# EAGLE design atmega128ictop (EAGLE 7.2.0)
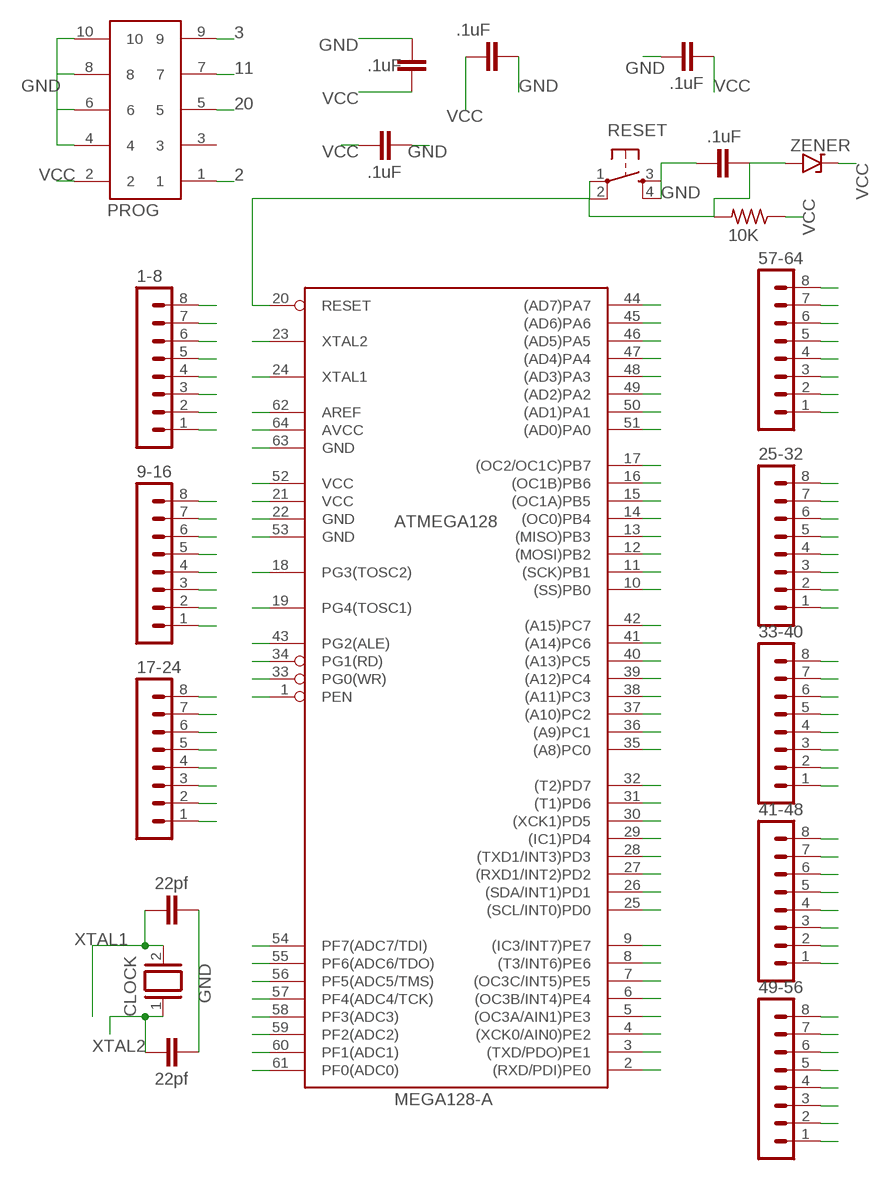
[diagram p0: schematic, sheet 1]

## Parts
1-8  MA08-1  [MA08-1]
9-16  MA08-1  [MA08-1]
17-24  MA08-1  [MA08-1]
25-32  MA08-1  [MA08-1]
33-40  MA08-1  [MA08-1]
41-48  MA08-1  [MA08-1]
49-56  MA08-1  [MA08-1]
57-64  MA08-1  [MA08-1]
ATMEGA128  MEGA128-A  [TQFP64]
C1  .1uF  C5/2.5  [C5B2.5]
C2  .1uF  C5/2.5  [C5B2.5]
C3  22pf  C5/2.5  [C5B2.5]
C4  22pf  C5/2.5  [C5B2.5]
C5  .1uF  C5/2.5  [C5B2.5]
C6  .1uF  C5/2.5  [C5B2.5]
C7  .1uF  C5/2.5  [C5B2.5]
CLOCK  XTAL/S  [QS]
D1  ZENER  1N9ZENER2  [DO35-2]
PROG  61201021621  [61201021621]
R1  10K  R-US_0204/5  [0204/5]
RESET  DTS-6  [DTS-6]

## Nets
1: 1-8.1 ATMEGA128.1(PEN)
2: 1-8.2 ATMEGA128.2((RXD/PDI)PE0) PROG.1
3: 1-8.3 ATMEGA128.3((TXD/PDO)PE1) PROG.9
4: 1-8.4 ATMEGA128.4((XCK0/AIN0)PE2)
5: 1-8.5 ATMEGA128.5((OC3A/AIN1)PE3)
6: 1-8.6 ATMEGA128.6((OC3B/INT4)PE4)
7: 1-8.7 ATMEGA128.7((OC3C/INT5)PE5)
8: 1-8.8 ATMEGA128.8((T3/INT6)PE6)
9: 9-16.1 ATMEGA128.9((IC3/INT7)PE7)
10: 9-16.2 ATMEGA128.10((SS)PB0)
11: 9-16.3 ATMEGA128.11((SCK)PB1) PROG.7
12: 9-16.4 ATMEGA128.12((MOSI)PB2)
13: 9-16.5 ATMEGA128.13((MISO)PB3)
14: 9-16.6 ATMEGA128.14((OC0)PB4)
15: 9-16.7 ATMEGA128.15((OC1A)PB5)
16: 9-16.8 ATMEGA128.16((OC1B)PB6)
17: 17-24.1 ATMEGA128.17((OC2/OC1C)PB7)
18: 17-24.2 ATMEGA128.18(PG3(TOSC2))
19: 17-24.3 ATMEGA128.19(PG4(TOSC1))
20: 17-24.4 ATMEGA128.20(RESET) C5.1 D1.A PROG.5 R1.2 RESET.1 RESET.2
25: 25-32.1 ATMEGA128.25((SCL/INT0)PD0)
26: 25-32.2 ATMEGA128.26((SDA/INT1)PD1)
27: 25-32.3 ATMEGA128.27((RXD1/INT2)PD2)
28: 25-32.4 ATMEGA128.28((TXD1/INT3)PD3)
29: 25-32.5 ATMEGA128.29((IC1)PD4)
30: 25-32.6 ATMEGA128.30((XCK1)PD5)
31: 25-32.7 ATMEGA128.31((T1)PD6)
32: 25-32.8 ATMEGA128.32((T2)PD7)
33: 33-40.1 ATMEGA128.33(PG0(WR))
34: 33-40.2 ATMEGA128.34(PG1(RD))
35: 33-40.3 ATMEGA128.35((A8)PC0)
36: 33-40.4 ATMEGA128.36((A9)PC1)
37: 33-40.5 ATMEGA128.37((A10)PC2)
38: 33-40.6 ATMEGA128.38((A11)PC3)
39: 33-40.7 ATMEGA128.39((A12)PC4)
40: 33-40.8 ATMEGA128.40((A13)PC5)
41: 41-48.1 ATMEGA128.41((A14)PC6)
42: 41-48.2 ATMEGA128.42((A15)PC7)
43: 41-48.3 ATMEGA128.43(PG2(ALE))
44: 41-48.4 ATMEGA128.44((AD7)PA7)
45: 41-48.5 ATMEGA128.45((AD6)PA6)
46: 41-48.6 ATMEGA128.46((AD5)PA5)
47: 41-48.7 ATMEGA128.47((AD4)PA4)
48: 41-48.8 ATMEGA128.48((AD3)PA3)
49: 49-56.1 ATMEGA128.49((AD2)PA2)
50: 49-56.2 ATMEGA128.50((AD1)PA1)
51: 49-56.3 ATMEGA128.51((AD0)PA0)
54: 49-56.6 ATMEGA128.54(PF7(ADC7/TDI))
55: 49-56.7 ATMEGA128.55(PF6(ADC6/TDO))
56: 49-56.8 ATMEGA128.56(PF5(ADC5/TMS))
57: 57-64.1 ATMEGA128.57(PF4(ADC4/TCK))
58: 57-64.2 ATMEGA128.58(PF3(ADC3))
59: 57-64.3 ATMEGA128.59(PF2(ADC2))
60: 57-64.4 ATMEGA128.60(PF1(ADC1))
61: 57-64.5 ATMEGA128.61(PF0(ADC0))
62: 57-64.6
GND: 17-24.6 49-56.5 57-64.7 ATMEGA128.22(GND) ATMEGA128.53(GND) ATMEGA128.63(GND) C1.1 C2.2 C3.2 C4.2 C5.2 C6.2 C7.2 PROG.4 PROG.6 PROG.8 PROG.10 RESET.3 RESET.4
VCC: 17-24.5 49-56.4 57-64.8 ATMEGA128.21(VCC) ATMEGA128.52(VCC) ATMEGA128.62(AREF) ATMEGA128.64(AVCC) C1.2 C2.1 C6.1 C7.1 D1.C PROG.2 R1.1
XTAL1: 17-24.8 ATMEGA128.24(XTAL1) C3.1 CLOCK.2
XTAL2: 17-24.7 ATMEGA128.23(XTAL2) C4.1 CLOCK.1
Unconnected: PROG.3

## Library data of the parts
1-8 9-16 17-24 25-32 33-40 41-48 49-56 57-64 = con-lstb:MA08-1: PIN HEADER; OC_FARNELL: unknown; OC_NEWARK: unknown
ATMEGA128 = atmel:MEGA128: MICROCONTROLLER 128 Kbytes FLASH 4 Kbytes SRAM 4 Kbytes EEPROM DUAL USART 8-channel 10 bit ADC Source: avr.lbr; MPN: ATMEGA128-16AU; OC_FARNELL: 9171118; OC_NEWARK: 95K7364
C1-C7 = capacitor-wima:C: CAPACITOR naming: grid - package width
CLOCK = special:XTAL/S: CRYSTAL
D1 = gm-diodes:1N9*ZENER: 1N9???B Zener Diode DO-35 case 1N957B - 1N992B (6.8V to 200V)
PROG = Wurth_Elektronik_Electromechanic_Wire_to_Board_Connectors_rev15c:61201021621: WR-BHD 2.54mm Male Box Header, 10 Pins=>Code : Con_WTB_BHD_2.54_Male_THT_WS_61201021621 <http://katalog.we-online.de/media/thumbs2/eican/thb_Con_WTB_BHD_2.54_Male_THT_WS_6120xx21621_pf2.jpg> Details see: http://katalog.we-online.de/en/em/612_0xx_216_21 Created 2014-06-04, Karrer Zheng 2014 (C) Würth Elektronik
R1 = resistor:R-US_: RESISTOR, American symbol
RESET = switch-tact:DTS-6

## Net classes
0 default: clearance 0.205 mm

## Board
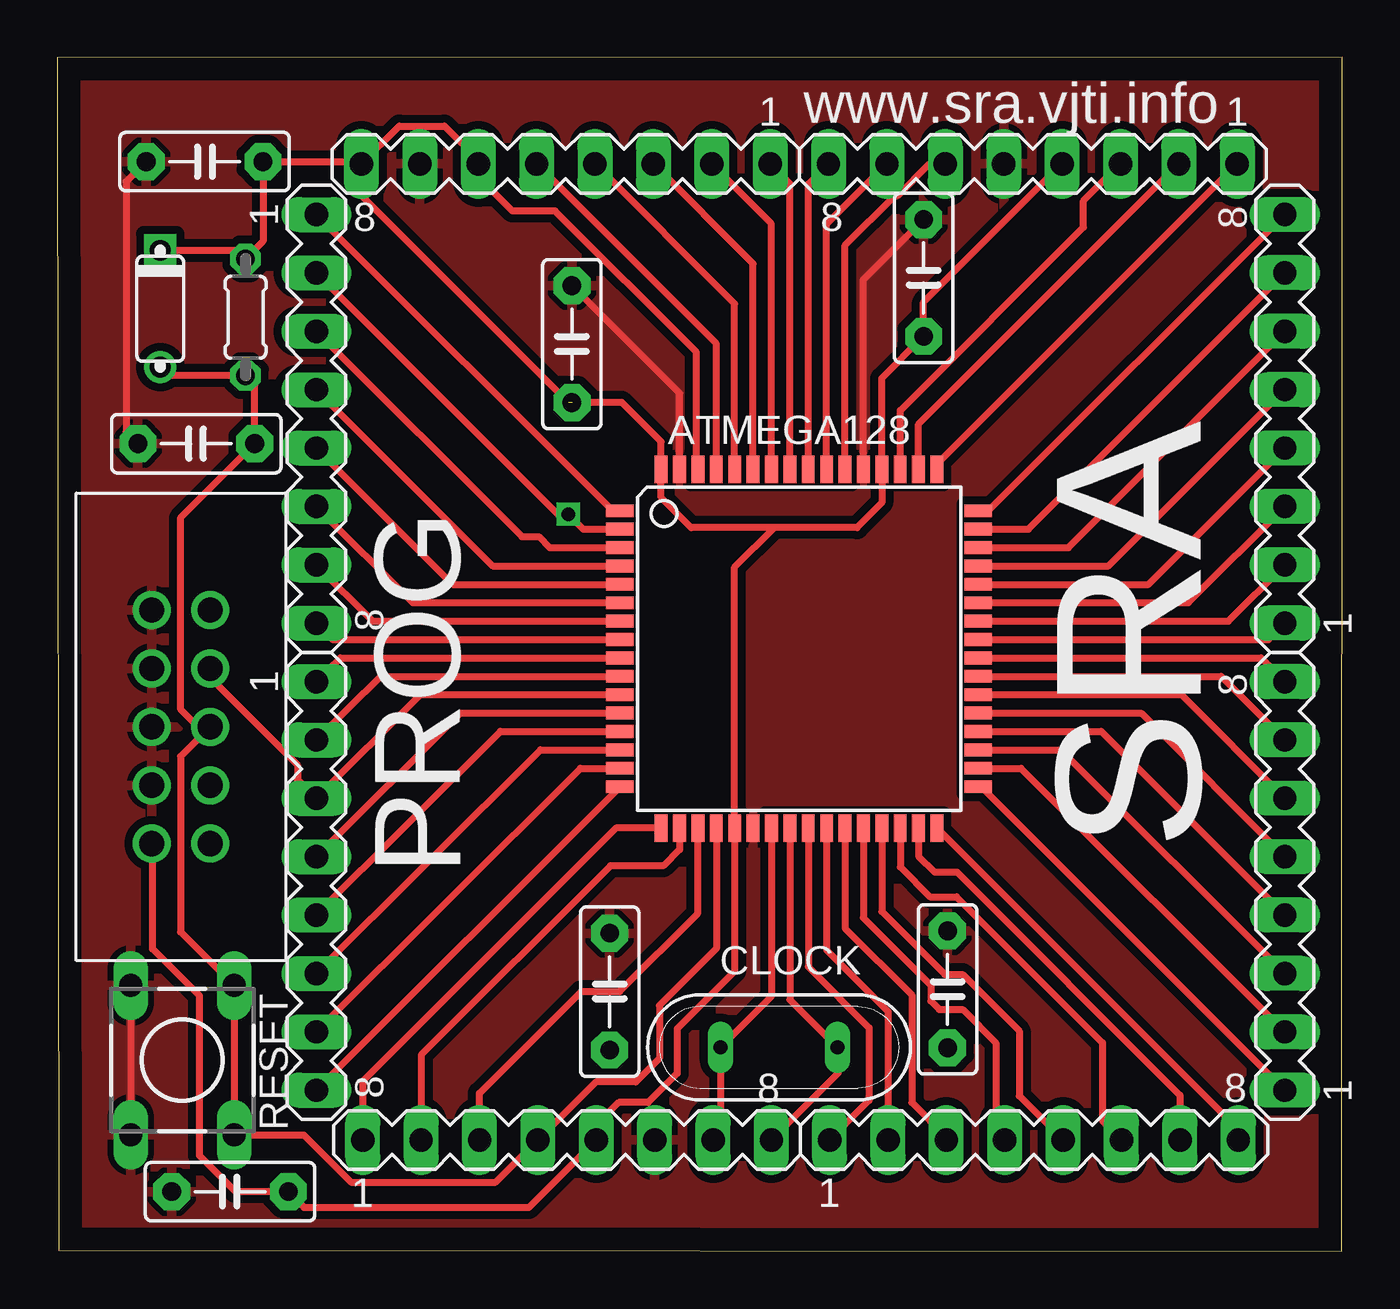
[diagram p1: board, top side]
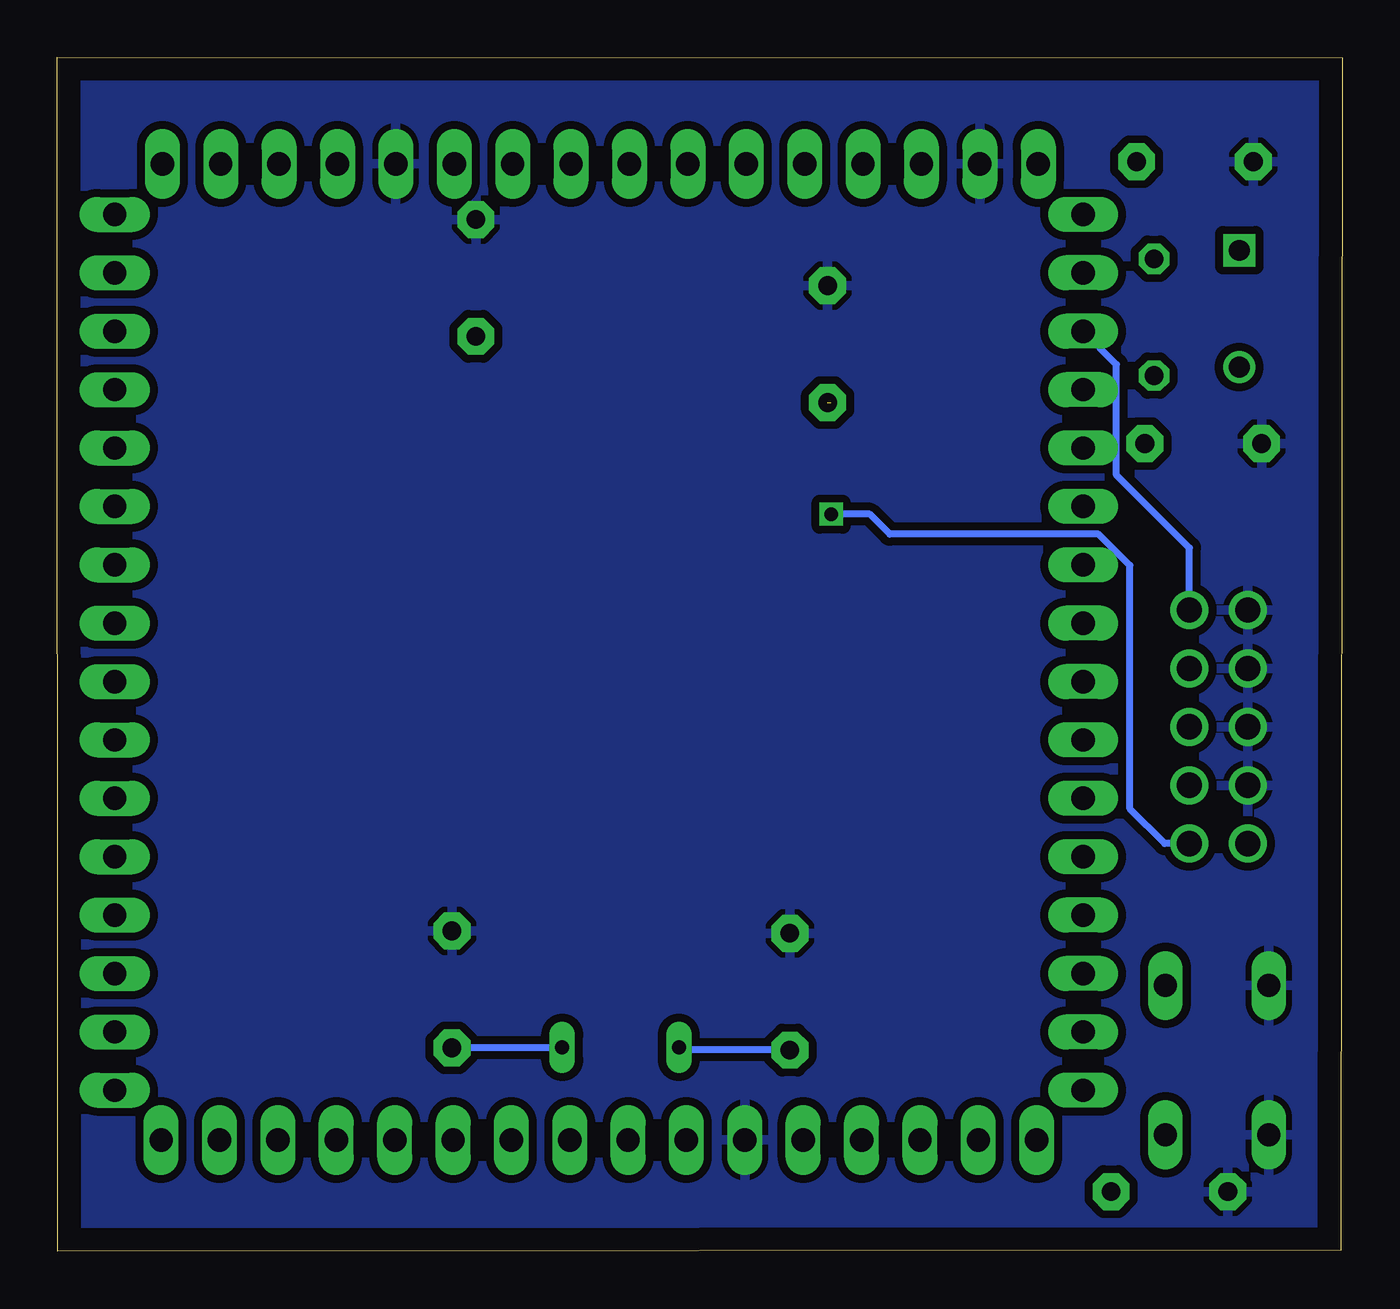
[diagram p2: board, bottom side, seen from below]

Size 55.88 x 51.93 mm. Coordinates in mm from the lower left corner, seen from the top.
Outline: 0.05,0.03 55.87,0 55.88,51.93 0,51.92 0.05,0.03
Copper layers (1*16): Top 0.035mm / dielectric 1.5mm / Bottom 0.035mm
Design rules "default *": minimum track width 10mil, minimum drill 10mil, track to track 0.35mm, track to pad 0.25mm, pad to pad 8mil, via to via 8mil, smd to smd 8mil, copper to edge 40mil, drill to drill 8mil, minimum pad ring 10mil, minimum via ring 8mil, stop-mask expansion 4mil, vias tented up to drill 0mil, thermal gap 10mil

### Footprints (pad centres in the part's own frame; a part is rotated, then mirrored left to right if it is on the bottom)
MA08-1 = drill 1.016 long: 1 -8.89,0; 2 -6.35,0; 3 -3.81,0; 4 -1.27,0; 5 1.27,0; 6 3.81,0; 7 6.35,0; 8 8.89,0
TQFP64 = smd 1.194 x 0.559: 1 -7.8,6; 2 -7.8,5.2; 3 -7.8,4.4; 4 -7.8,3.6; 5 -7.8,2.8; 6 -7.8,2; 7 -7.8,1.2; 8 -7.8,0.4; 9 -7.8,-0.4; 10 -7.8,-1.2; 11 -7.8,-2; 12 -7.8,-2.8; 13 -7.8,-3.6; 14 -7.8,-4.4; 15 -7.8,-5.2; 16 -7.8,-6; 33 7.8,-6; 34 7.8,-5.2; 35 7.8,-4.4; 36 7.8,-3.6; 37 7.8,-2.8; 38 7.8,-2; 39 7.8,-1.2; 40 7.8,-0.4; 41 7.8,0.4; 42 7.8,1.2; 43 7.8,2; 44 7.8,2.8; 45 7.8,3.6; 46 7.8,4.4; 47 7.8,5.2; 48 7.8,6 | smd 0.559 x 1.194: 17 -6,-7.8; 18 -5.2,-7.8; 19 -4.4,-7.8; 20 -3.6,-7.8; 21 -2.8,-7.8; 22 -2,-7.8; 23 -1.2,-7.8; 24 -0.4,-7.8; 25 0.4,-7.8; 26 1.2,-7.8; 27 2,-7.8; 28 2.8,-7.8; 29 3.6,-7.8; 30 4.4,-7.8; 31 5.2,-7.8; 32 6,-7.8; 49 6,7.8; 50 5.2,7.8; 51 4.4,7.8; 52 3.6,7.8; 53 2.8,7.8; 54 2,7.8; 55 1.2,7.8; 56 0.4,7.8; 57 -0.4,7.8; 58 -1.2,7.8; 59 -2,7.8; 60 -2.8,7.8; 61 -3.6,7.8; 62 -4.4,7.8; 63 -5.2,7.8; 64 -6,7.8
C5B2.5 = drill 0.813 pad 1.6 octagon: 1 -2.54,0; 2 2.54,0
QS = drill 0.61 long: 1 -2.54,0; 2 2.54,0
DO35-2 = drill 0.9: A 2.54,0 | drill 0.9 square: C -2.54,0
61201021621 = drill 1.1: 1 -2.54,-1.27; 2 -2.54,1.27; 3 0,-1.27; 4 0,1.27; 5 2.54,-1.27; 6 2.54,1.27; 7 5.08,-1.27; 8 5.08,1.27; 9 7.62,-1.27; 10 7.62,1.27
0204/5 = drill 0.813 octagon: 1 -2.54,0; 2 2.54,0
DTS-6 = drill 1 long: 1 -3.25,2.25; 2 3.25,2.25; 3 -3.25,-2.25; 4 3.25,-2.25

### Placement (x,y rotation side)
1-8  11.26,36.21 270 top
9-16  11.26,15.89 270 top
17-24  22.17,4.84 0 top
25-32  42.48,4.84 0 top
33-40  53.39,15.89 90 top
41-48  53.39,36.21 90 top
49-56  42.43,47.3 180 top
57-64  22.11,47.3 180 top
ATMEGA128  32.26,26.21 0 top
C1  6.4,47.4 0 top
C2  7.51,2.59 180 top
C3  38.72,11.39 90 top
C4  24.02,11.29 90 top
C5  6.04,35.13 180 top
C6  22.38,39.46 90 top
C7  37.68,42.34 90 top
CLOCK  31.39,8.87 0 top
D1  4.47,41 270 top
PROG  5.37,20.27 90 top
R1  8.18,40.63 270 top
RESET  5.43,8.31 270 top

### Tracks (layer width: path | path; a pad name or v marks a point on that pad's centre or on a via)
1
  Top 0.305: 1-8.1 24.15,32.21 ATMEGA128.1
2  (via drill 0.6)
  Top 0.305: ATMEGA128.2 22.87,31.41 v22.22,32.06 21.76,32.06 1-8.2
  Bottom 0.305: PROG.1 7.71,17.73 9.23,19.25 9.23,29.83 10.59,31.19 19.67,31.19 20.54,32.06 v22.22,32.06
3
  Top 0.305: ATMEGA128.3 21.41,30.61 20.94,31.08 20.2,31.08 1-8.3
  Bottom 0.305: PROG.9 6.64,30.59 9.81,33.76 9.81,38.57 1-8.3
4
  Top 0.305: 1-8.4 18.93,29.81 ATMEGA128.4
5
  Top 0.305: 1-8.5 17.19,29.01 ATMEGA128.5
6
  Top 0.305: 1-8.6 15.45,28.21 ATMEGA128.6
7
  Top 0.305: 1-8.7 13.71,27.41 ATMEGA128.7
8
  Top 0.305: 1-8.8 11.97,26.61 ATMEGA128.8
9
  Top 0.305: 9-16.1 12.31,25.81 ATMEGA128.9
10
  Top 0.305: 9-16.2 14.05,25.01 ATMEGA128.10
11
  Top 0.305: ATMEGA128.11 15.79,24.21 9-16.3 10.44,20.52 10.44,21.15 6.64,24.95 PROG.7
12
  Top 0.305: 9-16.4 17.53,23.41 ATMEGA128.12
13
  Top 0.305: 9-16.5 19.27,22.61 ATMEGA128.13
14
  Top 0.305: 9-16.6 21.01,21.81 ATMEGA128.14
15
  Top 0.305: 9-16.7 22.75,21.01 ATMEGA128.15
16
  Top 0.305: 9-16.8 24.46,20.18 ATMEGA128.16
17
  Top 0.305: ATMEGA128.17 24.29,18.41 13.28,7.4 17-24.1
18
  Top 0.305: ATMEGA128.18 27.06,17.47 26.36,16.77 24.05,16.77 15.82,8.54 17-24.2
19
  Top 0.305: 17-24.3 18.36,6.87 22.79,11.3 24.46,11.3 27.86,14.7 ATMEGA128.19
20
  Top 0.305: D1.A 4.84,38.09 R1.2 8.58,37.69 C5.1 5.34,31.89 5.34,23.59 6.12,22.81 PROG.5 5.36,21.53 5.36,13.88 RESET.1 RESET.2 10.71,5.06 12.77,3 19.06,3 17-24.4 23.42,7.36 25.16,7.36 26.18,8.38 26.18,10.69 28.66,13.17 ATMEGA128.20
25
  Top 0.305: ATMEGA128.25 32.66,12.37 35.31,9.72 35.31,6.56 25-32.1
26
  Top 0.305: ATMEGA128.26 33.46,13.1 36.13,10.43 25-32.2
27
  Top 0.305: ATMEGA128.27 34.26,14.05 37.16,11.15 37.16,6.47 38.67,4.96 25-32.3
28
  Top 0.305: ATMEGA128.28 35.06,14.5 37.99,11.57 37.99,10.88 38.36,10.51 39.38,10.51 40.82,9.07 40.82,5.23 25-32.4
29
  Top 0.305: ATMEGA128.29 35.86,14.78 38.6,12.04 39.38,12.04 41.84,9.58 41.84,6.75 25-32.5
30
  Top 0.305: ATMEGA128.30 36.66,16.71 37.95,15.42 39.11,15.42 45.46,9.07 45.46,5.67 25-32.6
31
  Top 0.305: ATMEGA128.31 37.46,17.18 38.15,16.49 39.13,16.49 48.83,6.79 25-32.7
32
  Top 0.305: ATMEGA128.32 51.37,5.3 25-32.8
33
  Top 0.305: ATMEGA128.33 40.18,20.21 33-40.1
34
  Top 0.305: ATMEGA128.34 41.92,21.01 33-40.2
35
  Top 0.305: ATMEGA128.35 43.66,21.81 33-40.3
36
  Top 0.305: ATMEGA128.36 45.4,22.61 33-40.4
37
  Top 0.305: ATMEGA128.37 47.14,23.41 33-40.5
38
  Top 0.305: ATMEGA128.38 48.88,24.21 33-40.6
39
  Top 0.305: ATMEGA128.39 50.62,25.01 33-40.7
40
  Top 0.305: ATMEGA128.40 52.36,25.81 33-40.8
41
  Top 0.305: ATMEGA128.41 52.68,26.61 41-48.1
42
  Top 0.305: ATMEGA128.42 50.94,27.41 41-48.2
43
  Top 0.305: ATMEGA128.43 49.2,28.21 41-48.3
44
  Top 0.305: ATMEGA128.44 47.46,29.01 41-48.4
45
  Top 0.305: ATMEGA128.45 45.72,29.81 41-48.5
46
  Top 0.305: ATMEGA128.46 43.98,30.61 41-48.6
47
  Top 0.305: ATMEGA128.47 42.24,31.41 41-48.7
48
  Top 0.305: ATMEGA128.48 40.5,32.21 41-48.8
49
  Top 0.305: ATMEGA128.49 38.26,34.24 49-56.1
50
  Top 0.305: ATMEGA128.50 37.46,35.98 49-56.2
51
  Top 0.305: ATMEGA128.51 36.66,36.57 44.63,44.54 44.63,45.69 49-56.3
54
  Top 0.305: ATMEGA128.54 34.26,43.76 36.42,45.92 36.56,45.92 37.94,47.3 49-56.6
55
  Top 0.305: ATMEGA128.55 33.46,44.68 49-56.7
56
  Top 0.305: ATMEGA128.56 32.66,46.42 49-56.8
57
  Top 0.305: ATMEGA128.57 31.86,46.44 57-64.1
58
  Top 0.305: ATMEGA128.58 31.06,44.7 57-64.2
59
  Top 0.305: ATMEGA128.59 30.26,42.96 57-64.3
60
  Top 0.305: ATMEGA128.60 29.46,41.22 57-64.4
61
  Top 0.305: ATMEGA128.61 28.66,39.48 57-64.5
GND
  Top 0.305: ATMEGA128.53 35.06,42.26 C7.2 | ATMEGA128.63 27.06,37.32 C6.2 | 3.9,34.73 C5.2 2.99,35.64 2.99,46.53 C1.1 | RESET.3 RESET.4
  pour Bottom: 0.19,51.78 55.68,51.7 55.66,0.22 0.25,0.22
  pour Top: 0.16,51.71 55.71,51.72 55.64,0.21 0.27,0.23
VCC  (1 unrouted)
  Top 0.305: 49-56.4 37.68,41.28 C7.1 35.86,37.98 ATMEGA128.52 35.86,32.56 34.78,31.48 31.18,31.48 | 31.18,31.48 27.57,31.48 26.26,32.79 ATMEGA128.64 26.26,35.21 24.55,36.92 C6.1 | ATMEGA128.62 27.79,34.08 27.79,39.11 21.65,45.25 19.79,45.25 18.27,46.77 18.33,46.83 18.33,47.46 16.84,48.95 14.87,48.95 57-64.8 | 31.18,31.48 29.46,29.76 ATMEGA128.21 29.46,12.18 26.96,9.68 26.96,7.73 25.7,6.47 24.41,6.47 23.44,5.5 17-24.5 20.51,1.91 10.73,1.91 C2.1 7.75,2.59 6.18,4.16 6.18,11.11 4.14,13.15 4.14,17.69 PROG.2 | D1.C 7.81,43.54 R1.1 8.94,43.93 C1.2 13.12,47.4 57-64.8 | 22.23,36.92 13.22,45.93 57-64.8
XTAL1
  Top 0.305: ATMEGA128.24 31.86,10.94 CLOCK.2 33.93,7.77 33.96,7.74 17-24.8
  Bottom 0.305: CLOCK.2 33.95,8.85 C3.1
XTAL2
  Top 0.305: ATMEGA128.23 31.06,11.08 CLOCK.1 28.85,5.17 17-24.7
  Bottom 0.305: C4.1 28.73,8.75 CLOCK.1

### Text on the board
tNames: www.sra.vjti.info | SRA